# EAGLE design NEO-Pi-RAK-3 (EAGLE 8.2.2)
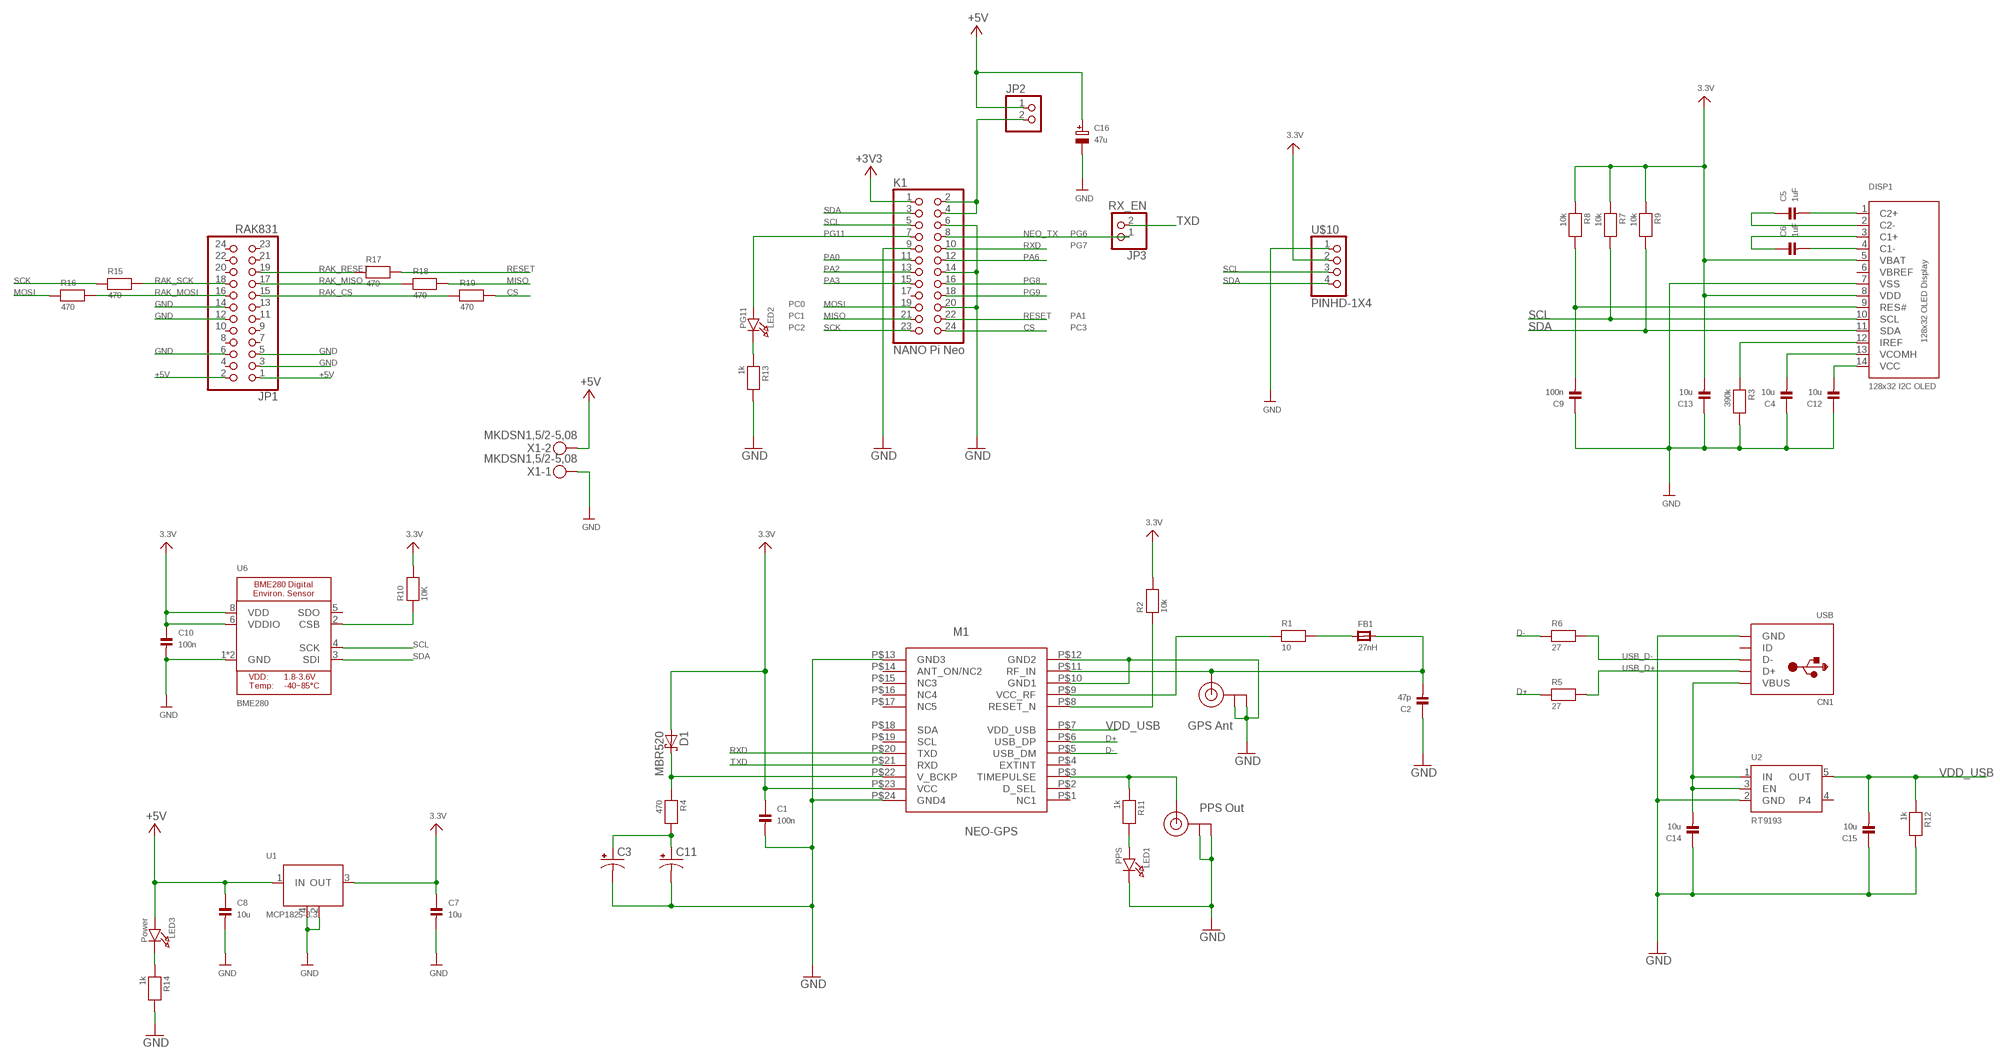
[diagram p0: schematic, sheet 1]

## Parts
C1  100n  CAP_CERAMIC0805  [0805]
C2  47p  CAP_CERAMIC0805  [0805]
C3  SUPERCAP  [414-VA5R]
C4  10u  CAP_CERAMIC0805  [0805]
C5  1uF  CAP_CERAMIC0805  [0805]
C6  1uF  CAP_CERAMIC0805  [0805]
C7  10u  CAP_CERAMIC0805  [0805]
C8  10u  CAP_CERAMIC0805  [0805]
C9  100n  CAP_CERAMIC0805  [0805]
C10  100n  CAP_CERAMIC0805  [0805]
C11  SUPERCAP  [SUPERCAP]
C12  10u  CAP_CERAMIC0805  [0805]
C13  10u  CAP_CERAMIC0805  [0805]
C14  10u  CAP_CERAMIC0805  [0805]
C15  10u  CAP_CERAMIC0805  [0805]
C16  47u  CAP_TANTALUMB/3528_REFLOW  [EIA3528-21/B-R]
CN1  USB  USBMINIB  [USB-MINIB]
D1  MBR520  MBR0520  [SOD123]
DISP1  128x32 I2C OLED  0.91-128X32-OLED-I2C  [0.91-128X32-OLED-I2C]
FB1  27nH  FERRITE0805  [0805]
JP1  RAK831  PINHD-2X12  [2X12]
JP2  PINHD-1X2  [1X02]
JP3  RX_EN  PINHD-1X2  [1X02]
K1  NANO Pi Neo  PINHD-2X12  [2X12]
LED1  PPS  LED0805  [CHIPLED_0805]
LED2  PG11  LED0805  [CHIPLED_0805]
LED3  Power  LED0805  [CHIPLED_0805]
M1  NEO-GPS  [NEO_GPS]
R1  10  RESISTOR0805  [0805]
R2  10k  RESISTOR0805  [0805]
R3  390k  RESISTOR0805  [0805]
R4  470  RESISTOR0805  [0805]
R5  27  RESISTOR0805  [0805]
R6  27  RESISTOR0805  [0805]
R7  10k  RESISTOR0805  [0805]
R8  10k  RESISTOR0805  [0805]
R9  10k  RESISTOR0805  [0805]
R10  10K  RESISTOR0805  [0805]
R11  1k  RESISTOR0805  [0805]
R12  1k  RESISTOR0805  [0805]
R13  1k  RESISTOR0805  [0805]
R14  1k  RESISTOR0805  [0805]
R15  470  RESISTOR0805  [0805]
R16  470  RESISTOR0805  [0805]
R17  470  RESISTOR0805  [0805]
R18  470  RESISTOR0805  [0805]
R19  470  RESISTOR0805  [0805]
U1  MCP1825-3.3  MCP1825ST-3.3  [UA78M05]
U2  RT9193  VREG_SOT23-5  [SOT23-5]
U6  BME280  [BME280]
U$1  U.FL  [U.FL]
U$2  U.FL  [U.FL]
U$10  PINHD-1X4  [1X04-BIG]
X1  MKDSN1,5/2-5,08  [MKDSN1,5/2-5,08]

## Nets
3.3V: C1.1 C7.1 C10.1 C13.2 D1.A DISP1.5(VBAT) DISP1.8(VDD) M1.P$23(VCC) R2.2 R7.1 R8.1 R9.1 R10.2 U1.3(OUT) U6.6(VDDIO) U6.8(VDD) U$10.2
+3V3: K1.1
+5V: C8.1 C16.+ JP1.1 JP1.2 JP2.1 LED3.A U1.1(IN) X1.2
CS: K1.24 R19.2
D+: M1.P$6(USB_DP) R5.1
D-: M1.P$5(USB_DM) R6.1
GND: C1.2 C2.1 C3.- C4.1 C7.2 C8.2 C9.1 C10.2 C11.P$2(-) C12.1 C13.1 C14.1 C15.1 C16.- CN1.GND DISP1.7(VSS) JP1.3 JP1.5 JP1.6 JP1.12 JP1.14 K1.6 K1.9 K1.14 K1.20 LED1.C M1.P$10(GND1) M1.P$12(GND2) M1.P$13(GND3) M1.P$24(GND4) R3.2 R12.2 R13.2 R14.2 U1.2(COMMON1) U1.4(COMMON2) U2.2(GND) U6.1(GND) U6.7(GND) U$1.P$1(GND) U$1.P$2(GND) U$2.P$1(GND) U$2.P$2(GND) U$10.1 X1.1
MISO: K1.21 R18.2
MOSI: K1.19 R16.1
N$1: JP2.2 K1.2 K1.4
N$2: M1.P$3(TIMEPULSE) R11.1 U$2.P$3(SIGNAL)
N$3: C2.2 FB1.2 M1.P$11(RF_IN) U$1.P$3(SIGNAL)
N$4: FB1.1 R1.2
N$5: C12.2 DISP1.14(VCC)
N$6: M1.P$9(VCC_RF) R1.1
N$7: M1.P$8(RESET_N) R2.1
N$8: D1.C M1.P$22(V_BCKP) R4.1
N$9: C3.+ C11.P$1(+) R4.2
N$10: C4.2 DISP1.13(VCOMH)
N$11: LED1.A R11.2
N$12: C5.2 DISP1.1(C2+)
N$13: C6.2 DISP1.4(C1-)
N$14: C6.1 DISP1.3(C1+)
N$15: C5.1 DISP1.2(C2-)
N$16: C14.2 CN1.VBUS U2.1(IN) U2.3(EN)
N$17: DISP1.12(IREF) R3.1
N$18: LED3.C R14.1
N$19: R10.1 U6.2(CSB)
N$20: LED2.C R13.1
NEO_TX: JP3.1 K1.8
PA0: K1.11
PA2: K1.13
PA3: K1.15
PA6: K1.12
PG8: K1.16
PG9: K1.18
PG11: K1.7 LED2.A
RAK_CS: JP1.15 R19.1
RAK_MISO: JP1.17 R18.1
RAK_MOSI: JP1.16 R16.2
RAK_RESET: JP1.19 R17.1
RAK_SCK: JP1.18 R15.2
RESET: K1.22 R17.2
RST_OLED: C9.2 DISP1.9(RES#) R8.2
RXD: K1.10 M1.P$20(TXD)
SCK: K1.23 R15.1
SCL: DISP1.10(SCL) K1.5 R7.2 U6.4(SCK) U$10.3
SDA: DISP1.11(SDA) K1.3 R9.2 U6.3(SDI) U$10.4
TXD: JP3.2 M1.P$21(RXD)
USB_D+: CN1.D+ R5.2
USB_D-: CN1.D- R6.2
VDD_USB: C15.2 M1.P$7(VDD_USB) R12.1 U2.5(OUT)
Unconnected: CN1.ID JP1.4 JP1.7 JP1.8 JP1.9 JP1.10 JP1.11 JP1.13 JP1.20 JP1.21 JP1.22 JP1.23 JP1.24 K1.17 M1.P$1(NC1) M1.P$2(D_SEL) M1.P$4(EXTINT) M1.P$14(ANT_ON/NC2) M1.P$15(NC3) M1.P$16(NC4) M1.P$17(NC5) M1.P$18(SDA) M1.P$19(SCL) U2.4 U6.5(SDO)

## Notes on the sheet
- PG6
- PG7
- PC0
- PC1 | PA1
- PC2 | PC3
- GPS Ant
- PPS Out

## Power pins joined to a net without a drawn wire
VBREF: DISP1.6(VBREF)

## Library data of the parts
C1 C2 C4-C10 C12-C15 = microbuilder:CAP_CERAMIC: Ceramic Capacitors 0402 - 0402 Surface Mount Capacitors 16pF 50V 5% [Digikey: 445-4899-2-ND] 18pF 50V 5% [Digikey: 490-1281-2-ND] 22pF 50V 5% [Digikey: 490-1283-2-ND] 68pF 50V 5% [Digikey: 490-1289-2-ND] 0.1uF 10V 10% [Digikey: 490-1318-2-ND] 1.0uF 6.3V 10% [Digikey: 490-1320-2-ND] 0603 - 0603 Surface Mount Capacitors 16 pF 50V 5% [Digikey: 445-5051-2-ND] 22 pF 50V [Digikey: PCC220ACVTR-ND] 33 pF 50V 5% [Digikey: 490-1415-1-ND] 56pF 50V 5% [Digikey: 490-1421-1-ND] 220pF 50V 5% [Digikey: 445-1285-1-ND] 680 pF 50V 2200 pF 50V 5% C0G [Digikey: 445-1297-1-ND] 5600 pF 100V 5% X7R [Digikey: 478-3711-1-ND] 0.1 µF 25V 10% [Digikey: PCC2277TR-ND] 0.22 µF 16V 10% X7R [Digikey: 445-1318-1-ND] 1.0 µF 25V 10% [Digikey: 445-5146-2-ND] 0603 - RF Specific 3pF 250V +/-0.1pF RF [Digikey: 712-1347-1-ND] 18 pF 250V 5% [Digikey: 478-3505-1-ND or 712-1322-1-ND] 56 pF 250V 5% C0G RF [Digikey: 490-4867-1-ND] 68 pF 250V RF [Digikey: 490-4868-1-ND] 0805 - 0805 Surface Mount Capacitors 220 pF 250V 2% RF Ceramic Capacitor [Digikey: 712-1398-1-ND] 1000 pF 50V 2% NP0 Ceramic Capacitor [Digikey: 478-3760-1-ND] 0.1 µF 25V 10% Ceramic Capacitor [Digikey: PCC1828TR-ND] 1.0 µF 16V 10% Ceramic Capacitor[Digikey: 490-1691-2-ND] 10.0 µF 10V 10% Ceramic Capacitor[Digikey: 709-1228-1-ND] 10.0 uF 16V 10% Ceramic Capacitor [Digikey: 478-5165-2-ND] 47 uF 6.3V 20% Ceramic Capacitor [Digikey: 587-1779-1-ND or 399-5506-1-ND] 1206 - 1206 Surface Mount Capacitors 47uF 10V 20% Ceramic Capacitor [Digikey: 490-5528-1-ND or 399-5508-1-ND or 445-6010-1-ND] 100uF 6.3V -20%, +80% Y5V Ceramic Capacitor (Digikey: 490-4512-1-ND, Mouser: 81-GRM31CF50J107ZE1L)
C3 = adafruit:SUPERCAP
C11 = Peters:SUPERCAP
C16 = microbuilder:CAP_TANTALUM: Tantalum Capacitors Wave footprints have larger pads and are meant to be used for hand soldering. Reflow footprints are optimised for solder paste and a reflow oven. EIA3216-18/A-[R/W] - Size A / 3216-18 / 1206 footprint 4.7µF 25V 10% Tantalum Capacitor 10µF 16V 10% Tantalum Capacitor [Digikey: 495-2236-2-ND] EIA3528-21/B-[R/W] - Size B / 3528-21 47µF 10V 10% Tantalum Capactior [Digikey: 495-2216-1-ND] EIA6032-28/C-[R/W] - Size C / 6032-28 10µF 35V 20% Tantalum Capacitor [Digikey: 495-2285-1-ND] 100µF 16V 10% Tantalum Capactior [Digikey: 399-5214-1-ND]
CN1 = adafruit:USB: USB Connectors USBMINIB - Surface Mount Female Mini-B USB Connector 4UConnector: 06564 By microbuilder.eu Thru-hole RA Female Mini-B USB Connector 4UConnector: 18732 By ladyada.net
D1 = Peters:MBR0520
DISP1 = Peters:0.91-128X32-OLED-I2C: SSD1306 128x32 OLED Display - I2C
FB1 = microbuilder:FERRITE: Ferrite Bead 0603 MMZ1608B121C - 120 Ohm @ 100MHz, 600mA, 0.15 Ohm DC Resistance - Digikey: 445-2164-1-ND BK1608HW121-T - 120 Ohm, 600mA Ferrite Chip - Digikey: 587-1876-2-ND 0805 HZ0805B272R-10 - 2.7K Ohm @ 100MHz, 200mA, 0.8 Ohm DC Resistance - Digikey: 240-2504-1-ND (see also Murata BLM21BD272SN1L) MMZ2012Y152B - 1.5K Ohm @ 100MHz, 500mA, 0.4 Ohm DC Resistance - Digikey: 445-1560-1-ND - Mainly for high frequency (80-400MHz) MMZ2012R102A - 1K Ohm @ 100MHz, 500mA, 0.3 Ohm DC Resistance - Digikey: 445-1555-2-ND - More general purpose (10-200MHz)
JP1 K1 = pinhead:PINHD-2X12: PIN HEADER
JP2 JP3 = pinhead:PINHD-1X2: PIN HEADER
LED1-LED3 = microbuilder:LED: LED 0603 - 0603 Surface Mount Package 2mA: Green LED - Low Power (3.9mcd, 2ma, 1.7Vf) - Digikey: 475-2709-2-ND Orange LED - Low Power (9.8mcd, 2ma, 1.8Vf) - Digikey: 475-1194-2-ND Red LED - Low Power (5mcd, 2ma, 1.8Vf) - Digikey: 475-1195-2-ND Yellow LED - Low Power (7mcd, 2ma, 1.8Vf) - Digikey: 475-1196-2-ND 5mA: Blue LED - Low Power (17mcd, 5ma, 2.9Vf) - Digikey: LNJ937W8CRACT-ND 0805 - 0805 Surface Mount Package 2mA: Red LED (8.8mcd, 2mA, 1.8Vf, Clear) - Low Power [Digikey: 475-2510-1-ND] Green LED (5mcd, 2mA, 1.8Vf, Clear) - Low Power [Digikey: 475-2730-1-ND] Yellow LED (11.3mcd, 2mA, 1.8Vf, Clear) - Low Power [Digikey: 475-2555-1-ND] 20mA: Red LED (104mcd, 20mA, Diffused) - LS R976 [Digikey: 475-1278-6-ND] Red LED (12mcd, 20mA, 2.0Vf, Clear) - APT2012EC [Digikey: 754-1128-1-ND] Green LED (15mcd, 20mA, 2.2Vf, Clear) - APT2012GC [Digikey: 754-1131-1-ND] Orange LED (160mcd, 20mA, 2.1Vf, Clear) - APT2012SECK [Digikey: 754-1130-1-ND] 1206 - 1206 Surface Mount Package Green LED (26mcd, 20mA, Diffused) - LG N971 [Digikey: 475-1407-6-ND] Red LED (15mcd, 20mA, Diffused) - LH N974 [Digikey: 475-1416-6-ND]
M1 = Peters:NEO-GPS
R1-R19 = microbuilder:RESISTOR: Resistors 0402 - 0402 Surface Mount Package 22 Ohm 1% 1/16W [Digikey: 311-22.0LRTR-ND] 33 Ohm 5% 1/16W 1.0K 5% 1/16W 1.5K 5% 1/16W 2.0K 1% 1/16W 10.0K 1% 1/16W [Digikey: 311-10.0KLRTR-ND] 10.0K 5% 1/16W [Digikey: RMCF0402JT10K0TR-ND] 12.1K 1% 1/16W [Digikey: 311-22.0LRTR-ND] 100.0K 5% 1/16W 0603 - 0603 Surface Mount Package 0 Ohm 1/10 Watt 1% Resistor 15 Ohm 1/10 Watt 1% Resistor 33 Ohm 1/10 Watt 1% Resistor 49.9 Ohm 1/10 Watt 1% Resistor 100 Ohm 1/10 Watt 1% Resistor 150 Ohm 1/10 Watt 1% Resistor 240 Ohm 1/10 Watt 1% Resistor 390 Ohm 1/10 Watt 1% Resistor 560 Ohm 1/10 Watt 1% Resistor 680 Ohm 1/10 Watt 1% Resistor 750 Ohm 1/10 Watt 1% Resistor 1.0K Ohm 1/10 Watt 1% Resistor 1.5K Ohm 1/10 Watt 1% Resistor 2.0K Ohm 1/10 Watt 1% Resistor 2.2K Ohm 1/10 Watt 1% Resistor 3.3K Ohm 1/10 Watt 1% Resistor 4.7K Ohm 1/10 Watt 1% Resistor 10.0K Ohm 1/10 Watt 1% Resistor 12.0K Ohm 1/10 Watt 1% Resistor 12.1K Ohm 1/10 Watt 1% Resistor 20.0K Ohm 1/10 Watt 1% Resistor 33.0K Ohm 1/10 Watt 1% Resistor 100.0K Ohm 1/10 Watt 1% Resistor 0805 - 0805 Surface Mount Package 0 Ohm 1/8 Watt 1% Resistor 33 Ohm 1/8 Watt 1% Resistor 100 Ohm 1/8 Watt 1% Resistor 150 Ohm 1/8 Watt 1% Resistor 200 Ohm 1/8 Watt 1% Resistor 240 Ohm 1/8 Watt 1% Resistor 330 Ohm 1/8 Watt 1% Resistor 390 Ohm 1/8 Watt 1% Resistor 470 Ohm 1/8 Watt 1% Resistor 1.0K Ohm 1/8 Watt 1% Resistor 1.5K Ohm 1/8 Watt 1% Resistor 2.0K Ohm 1/8 Watt 1% Resistor 4.7K Ohm 1/8 Watt 1% Resistor 5.1K Ohm 1/8 Watt 1% Resistor 5.6K Ohm 1/8 Watt 1% Resistor 10.0K Ohm 1/8 Watt 1% Resistor 22.0K Ohm 1/8 Watt 1% Resistor 33.0K Ohm 1/8 Watt 1% Resistor 100K Ohm 1/8 Watt 1% Resistor 1206 - 1206 Surface Mount Package 2012 - 2010 Surface Mount Package 0.11 Ohm 1/2 Watt 1% Resistor - Digikey: RHM.11UCT-ND
U1 = Peters:MCP1825ST-3.3: 3.3V LDO SOT223-3 Regulator
U2 = microbuilder:VREG_SOT23-5: SOT23-5 Fixed Voltage Regulators To better organise some of the SOT23-5 fixed voltage regulators in this library, this new part was created. Part Current Out V Out V In V Dropout Digikey Part No. ADP121 150mA 3.3V 3.4-5.5V 0.09V @ 150mA ADP121-AUJZ33R7CT-ND ADP121 150mA 3.0V 3.1-5.5V 0.09V @ 150mA ADP121-AUJZ30R7CT-ND ADP122 300mA 3.3V 3.4-5.5V 0.085V @ 300mA ADP122AUJZ-3.3-R7CT-ND ADP1712 300mA 3.3V 3.5-5.5V 0.17V @ 300mA ADP1712AUJZ-3.3-R7TR-ND AP7311 (Low Cost) 150mA 3.3V 3.5-6V 0.15V @ 150mA AP7311-33WG-7DICT-ND LD39015M18R 150mA 1.8V 1.9V-5.5V 0.08V @ 100mA 497-6977-1-ND MCP1824T-3302E/OT 300mA 3.3V 3.5V-6V 0.2V @ 300mA MCP1824T-3302E/OTCT-ND MIC5205-2.5YM5 TR 150mA 2.5V 2.7-16V 0.165V @ 150mA 576-1257-2-ND MIC5205-3.0YM5 TR 150mA 3.0V 3.2V-16V 0.165V @ 150mA 576-1258-2-ND MIC5205-3.3YM5 TR 150mA 3.3V 3.5V-16V 0.165V @ 150mA 576-1259-2-ND TPS780330220 150mA 3.3V+2.2V 3.6-5.5V 250mV Max 296-23332-1-ND TDA3663/N1,135 100mA 3.3V 3.5-45V 0.18V @ 50mA 568-5343-1-ND
U6 = microbuilder-3:BME280: BME280 - Environmental Sensor (I2C + SPI)
U$1 U$2 = Adafruit Ultimate GPS:U.FL: U.FL Antenna Connector
U$10 = adafruit:PINHD-1X4
X1 = con-phoenix-508:MKDSN1,5/2-5,08: MKDSN 1,5/ 2-5,08 Printklemme Nennstrom: 13,5 A Nennspannung: 250 V Rastermaß: 5,08 mm Polzahl: 2 Anschlussart: Schraubanschluss Montage: Löten Anschlussrichtung Leiter/Platine: 0 ° Artikelnummer: 1729128 Source: http://eshop.phoenixcontact.com .. 1729128.pdf

## Board
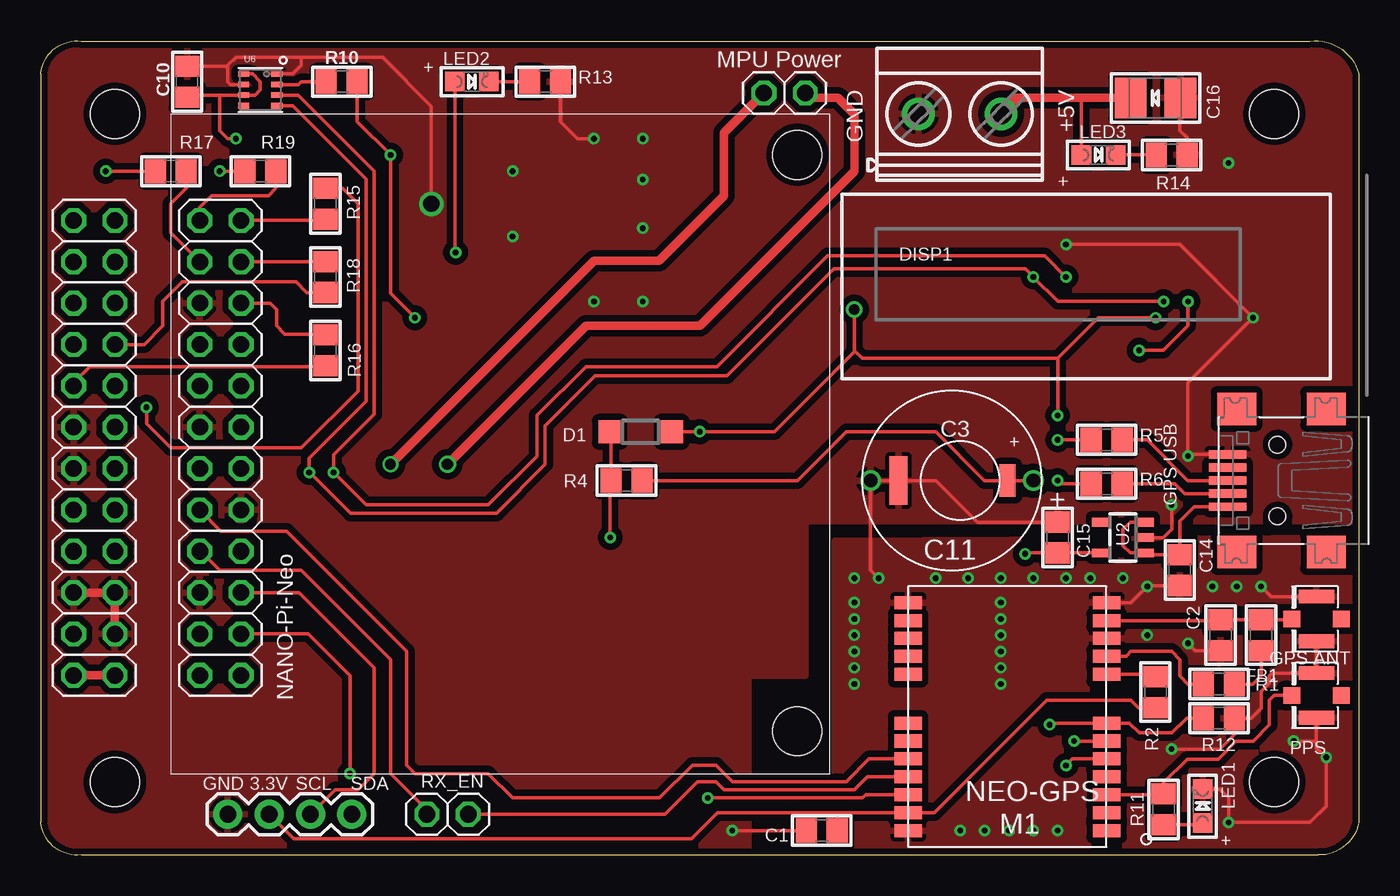
[diagram p1: board, top side]
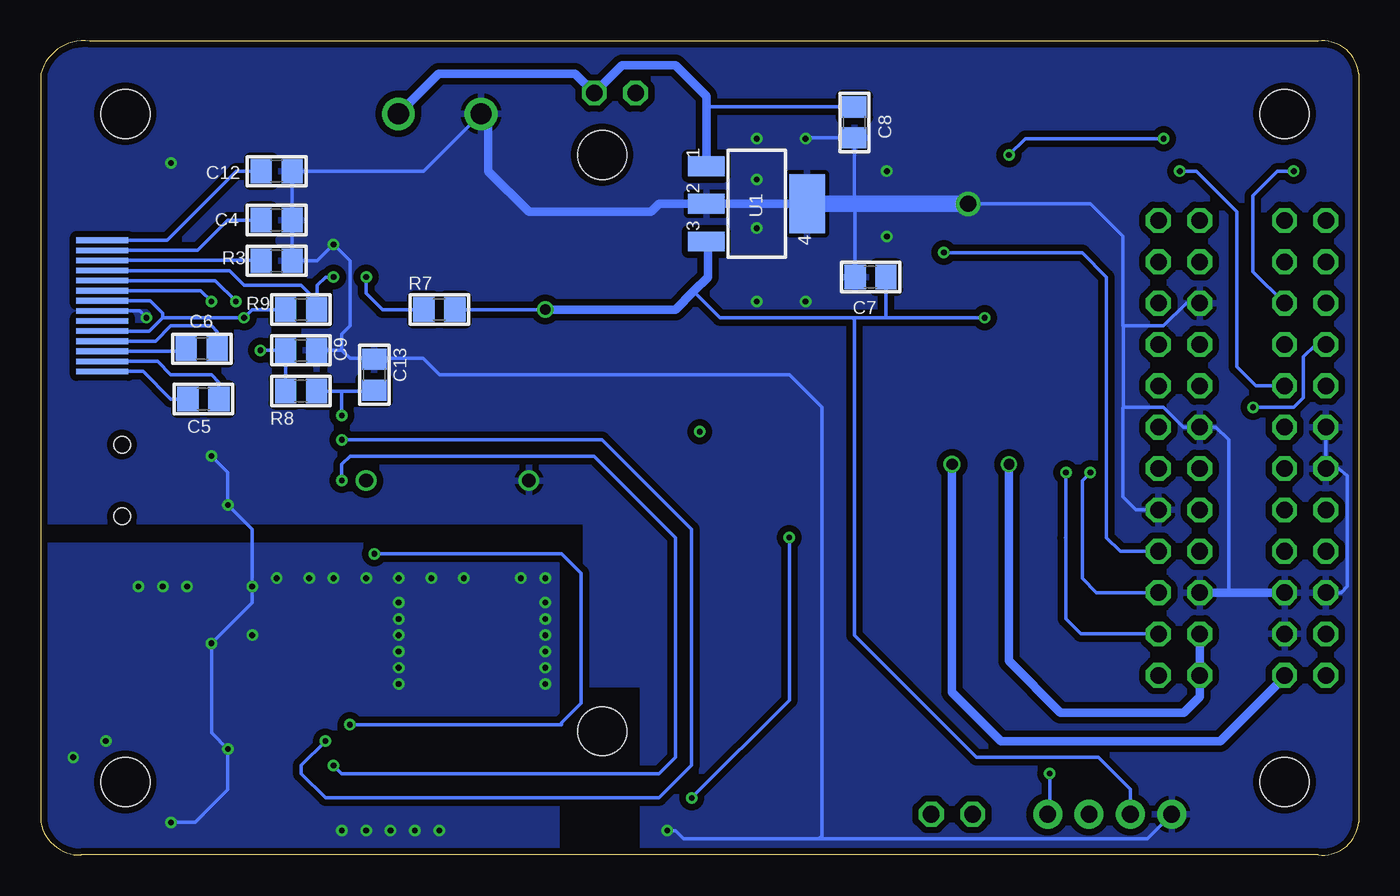
[diagram p2: board, bottom side, seen from below]

Size 81 x 50.03 mm. Coordinates in mm from the lower left corner, seen from the top.
Outline: 2.5,0.01 78.5,0.01 arc81 81,2.01 81,48.01 arc81 78,50.01 2.5,50.01 arc90 0,48.01 0,2.01 arc90 2.5,0.01
Copper layers (1*16): Top 0.0356mm / dielectric 1.5011mm / Bottom 0.0356mm
Design rules "oshpark-2layer": minimum track width 6mil, minimum drill 13mil, track to track 6mil, track to pad 6mil, pad to pad 6mil, via to via 6mil, smd to smd 6mil, copper to edge 15mil, drill to drill 6mil, minimum pad ring 7mil, minimum via ring 7mil, stop-mask expansion 2.5mil, vias tented up to drill 0mil, thermal gap 10mil
Holes 3 mm at 4.56,45.54 4.56,4.49 75.79,4.49 75.79,45.54 46.5,7.61 46.5,43.01

### Footprints (pad centres in the part's own frame; a part is rotated, then mirrored left to right if it is on the bottom)
0805 = smd 1.3 x 1.5: 1 -0.95,0; 2 0.95,0
414-VA5R = smd 1 x 2: + -2.9,0 | smd 1.1 x 3: - 3.8,0
SUPERCAP = drill 0.85: P$1 -5,0; P$2 5,0
EIA3528-21/B-R = smd 1.95 x 2.5: + 1.525,0; - -1.525,0
USB-MINIB = smd 0.5 x 2.308: D+ 0,4.064; D- -0.8,4.064; GND 1.6,4.064; ID 0.8,4.064; VBUS -1.6,4.064 | smd 2 x 2.4: GND1 -4.4,-2; GND2 -4.4,3.5; GND3 4.4,3.5; GND4 4.4,-2 | hole 1: -2.2,1; 2.2,1
SOD123 = smd 1.4 x 1.4: A 1.265,0; C -2.535,0
0.91-128X32-OLED-I2C = smd 3.2 x 0.35 bottom: 1 13.21,-5.3; 2 13.21,-4.68; 3 13.21,-4.06; 4 13.21,-3.44; 5 13.21,-2.82; 6 13.21,-2.2; 7 13.21,-1.58; 8 13.21,-0.96; 9 13.21,-0.34; 10 13.21,0.28; 11 13.21,0.9; 12 13.21,1.52; 13 13.21,2.14; 14 13.21,2.76
2X12 = drill 1.016 octagon: 1 -13.97,-1.27; 2 -13.97,1.27; 3 -11.43,-1.27; 4 -11.43,1.27; 5 -8.89,-1.27; 6 -8.89,1.27; 7 -6.35,-1.27; 8 -6.35,1.27; 9 -3.81,-1.27; 10 -3.81,1.27; 11 -1.27,-1.27; 12 -1.27,1.27; 13 1.27,-1.27; 14 1.27,1.27; 15 3.81,-1.27; 16 3.81,1.27; 17 6.35,-1.27; 18 6.35,1.27; 19 8.89,-1.27; 20 8.89,1.27; 21 11.43,-1.27; 22 11.43,1.27; 23 13.97,-1.27; 24 13.97,1.27
1X02 = drill 1.016 octagon: 1 -1.27,0; 2 1.27,0
CHIPLED_0805 = smd 1.2 x 1.2: A 0,-1.05; C 0,1.05
NEO_GPS = smd 1.7 x 0.8: P$1 0,0; P$2 0,1.1; P$3 0,2.2; P$4 0,3.3; P$5 0,4.4; P$6 0,5.5; P$7 0,6.6; P$8 0,9.6; P$9 0,10.7; P$10 0,11.8; P$11 0,12.9; P$12 0,14; P$13 -12.2,14; P$14 -12.2,12.9; P$15 -12.2,11.8; P$16 -12.2,10.7; P$17 -12.2,9.6; P$18 -12.2,6.6; P$19 -12.2,5.5; P$20 -12.2,4.4; P$21 -12.2,3.3; P$22 -12.2,2.2; P$23 -12.2,1.1; P$24 -12.2,0
UA78M05 = smd 1.219 x 2.235: 1 -2.311,-3.099; 2 0,-3.099; 3 2.311,-3.099 | smd 3.6 x 2.2: 4 0,3.099
SOT23-5 = smd 0.55 x 1.2: 1 -0.95,-1.3; 2 0,-1.3; 3 0.95,-1.3; 4 0.95,1.3; 5 -0.95,1.3
BME280 = smd 0.7 x 0.35: 1 1.025,0.975; 2 1.025,0.325; 3 1.025,-0.325; 4 1.025,-0.975; 5 -1.025,-0.975; 6 -1.025,-0.325; 7 -1.025,0.325; 8 -1.025,0.975
U.FL = smd 2.2 x 0.85: P$1 0,1.375; P$2 0,-1.375 | smd 1.05 x 1: P$3 1.525,0; P$4 -1.525,0
1X04-BIG = drill 1.016 pad 1.778: 1 0,0; 2 2.54,0; 3 5.08,0; 4 7.62,0
MKDSN1,5/2-5,08 = drill 1.3 pad 2: 1 -2.561,0.025; 2 2.519,0.025

### Placement (x,y rotation side)
C1  48,1.51 180 top
C2  72.5,13.51 90 top
C3  56.5,23.01 180 top
C4  66.5,39.01 180 bottom
C5  71,28.01 180 bottom
C6  71.1,31.11 0 bottom
C7  30,35.51 180 bottom
C8  31,45.01 270 bottom
C9  65,31.01 180 bottom
C10  9,47.51 90 top
C11  56,23.01 180 top
C12  66.5,42.01 180 bottom
C13  60.5,29.51 270 bottom
C14  70,17.51 90 top
C15  62.5,19.51 270 top
C16  68.5,46.51 180 top
CN1  77,23.01 90 top
D1  37.5,26.01 0 top
DISP1  64,35.01 0 top
FB1  75,13.51 90 top
JP1  3.29,25.02 90 top
JP2  45.71,46.82 180 top
JP3  25,2.51 0 top
K1  11.05,25.02 90 top
LED1  71.4,3.01 0 top
LED2  26.5,47.51 270 top
LED3  65,43.01 270 top
M1  65.5,1.51 0 top
R1  72.4,10.51 0 top
R2  68.5,10.01 270 top
R3  66.5,36.51 0 bottom
R4  36,23.01 0 top
R5  65.5,25.51 0 top
R6  65.5,22.81 0 top
R7  56.5,33.51 180 bottom
R8  65,28.51 180 bottom
R9  65,33.51 0 bottom
R10  18.5,47.51 0 top
R11  69,2.81 270 top
R12  72.4,8.41 0 top
R13  31,47.51 0 top
R14  69.5,43.01 0 top
R15  17.5,40.01 90 top
R16  17.5,31.01 270 top
R17  8,42.01 0 top
R18  17.5,35.51 90 top
R19  13.5,42.01 0 top
U1  37,40.01 270 bottom
U2  66.5,19.51 90 top
U6  13.5,47.01 0 top
U$1  78.4,14.51 180 top
U$2  78.4,9.81 180 top
U$10  11.5,2.51 0 top
X1  56.5,45.51 0 top

### Tracks (layer width: path | path; a pad name or v marks a point on that pad's centre or on a via)
3.3V  (via drill 0.35, 0.65)
  Top 0.2: U6.8 13.03,47.99 13.5,47.51 13.5,47.01 13.18,46.69 U6.6 11.11,46.69 | 11.11,46.69 9.03,46.69 C10.1 | R2.2 67.45,9.06 67,9.51 61.82,9.51 54.92,2.61 M1.P$23 49.02,2.61 | v62.5,27.01 62.5,30.51 | 62.5,30.51 65,33.01 v68.5,33.01 | 62.5,30.51 50.5,30.51 50.05,30.96 | 50.05,30.96 50,31.01 v50,33.51 | 50.05,30.96 45.1,26.01 v40.5,26.01 D1.A | 49.02,2.61 41.6,2.61 40,1.01 15.54,1.01 U$10.2 | C1.1 48.95,2.54 49.02,2.61 | R10.2 19.45,45.06 v21.5,43.01 21.5,34.51 v23,33.01 | v12,44.01 11.5,44.01 11,44.51 11,46.58 11.11,46.69
  Bottom 0.2: DISP1.8 74.27,34.05 73.5,33.28 73.5,33.01 | R9.1 68,33.51 v68.5,33.01 73.5,33.01 | DISP1.5 74.32,32.19 73.5,33.01 | 62.47,28.51 R8.1 | 62.47,28.51 60.55,28.51 C13.2 | v62.5,27.01 62.5,28.48 62.47,28.51 | v50,33.51 50.02,33.51 R7.1 | 31.12,33.01 33.03,33.01 | 28.98,33.01 31.12,33.01 | 28.98,33.01 v23,33.01 | 33.05,33.03 33.03,33.01 | 31.12,33.01 31,32.9 31,13.51 23.5,6.01 16,6.01 14.04,4.05 U$10.2 | C7.1 29.05,33.08 28.98,33.01 | 40.88,34.63 39.27,33.01 33.03,33.01 | v12,44.01 20.5,44.01 v21.5,43.01
  Bottom 0.508: U1.3 40.14,37.7 40,37.56 40,35.51 40.88,34.63 42,33.51 v50,33.51 | 50,33.53 50.02,33.51
+5V  (via drill 0.7)
  Top 0.2: LED3.A 63.95,46.43 64.04,46.51
  Top 0.508: JP1.2 JP1.1 | JP2.1 47.29,46.51 49,46.51 50,45.51 50,42.01 40.5,32.51 33.5,32.51 v25,24.01 | C16.+ 64.04,46.51 59.99,46.51 X1.2
  Bottom 0.2: C8.1 39.96,45.96 40.1,46.1
  Bottom 0.508: JP1.1 4.59,11.01 4.5,11.01 8.5,7.01 22,7.01 25,10.01 v25,24.01 | X1.2 56.54,48.01 48.17,48.01 JP2.1 45.29,48.51 42,48.51 40.1,46.61 40.1,46.1 U1.1
CS
  Top 0.2: K1.24 9.78,39.79 10.5,40.51 14,40.51 14.45,40.96 R19.2
D+  (via drill 0.35)
  Top 0.2: M1.P$6 v63.5,7.01 | R5.1 v62.5,25.51
  Bottom 0.2: v62.5,25.51 46.5,25.51 41,20.01 41,5.51 43,3.51 63.5,3.51 65,5.01 65,5.51 v63.5,7.01
D-  (via drill 0.35)
  Top 0.2: M1.P$5 63.4,5.91 v63,5.51 | R6.1 62.7,22.81 v62.5,23.01
  Bottom 0.2: v62.5,23.01 62.5,24.01 62,24.51 47,24.51 42,19.51 42,6.01 43,5.01 62.5,5.01 v63,5.51
GND  (via drill 0.35, 1)
  Top 0.2: 16.06,49.01 12,49.01 11.5,48.51 11.5,48.42 | U6.1 15.47,47.99 16,48.51 16,48.95 16.06,49.01 | 16.06,49.01 21,49.01 24,46.01 v24,40.01 | U$1.P$1 U$2.P$2 76.87,11.19 | C2.1 70.95,12.56 v70.5,13.01 | v69.5,6.51 72.46,6.51 73.35,7.41 R12.2 74.4,8.41 75,9.01 75,10.08 75.5,10.58 75.5,11.01 75.67,11.19 77,11.19 | 78.4,7.06 78.4,6.61 v79,6.01 79,3.01 78,2.01 v73,2.01 73,3.51 72.45,4.06 LED1.C | 78.4,7.06 U$2.P$1 77.42,8.44 | M1.P$12 67,15.51 v68,16.51 68.05,16.56 C14.1 | U2.2 69,19.51 69.5,20.01 v69.5,21.51 | CN1.GND 70.6,24.61 v70.5,24.51 70.5,29.01 v74.5,33.01 70,37.51 v63,37.51 | U$1.P$2 75.62,15.89 v75,16.51 | C1.2 v42.5,1.51 | C15.1 57.55,20.46 55,23.01 C3.- C11.P$2 51,17.51 v51.5,17.01 | R13.2 31.95,45.06 33,44.01 v34,44.01 | R14.2 70.45,44.06 70,44.51 70,46.49 C16.- | v77,7.01 78.35,7.01 78.4,7.06 | U6.7 11.68,47.34 11.5,47.51 11.5,48.42 | C10.2 11.45,48.46 11.5,48.42
  Top 0.508: JP1.3 JP1.5 JP1.6
  Bottom 0.2: JP1.14 JP1.12 1.24,23.75 0.7,23.31 0.7,16.51 1.08,16.13 JP1.6 | 14.5,32.51 12,32.51 10.6,33.91 K1.20 | K1.9 13.7,21.21 14.5,22.01 14.5,27.49 14.47,27.51 | 14.47,27.51 12,27.51 10.78,26.29 K1.14 8.78,26.29 8,25.51 8,16.3 8.17,16.13 | v73,2.01 71.5,2.01 69.5,4.01 v69.5,6.51 70.5,7.51 v70.5,13.01 68,15.51 v68,16.51 68,20.01 v69.5,21.51 69.5,23.51 v70.5,24.51 | DISP1.7 74.92,33.43 v74.5,33.01 | C9.1 62.5,31.01 | 62.5,31.01 62,30.51 60.55,30.51 | 60.55,30.51 C13.1 | X1.1 54.05,45.43 57.46,42.01 C12.1 C4.1 R3.2 64,36.51 v63,37.51 62,36.51 62,32.51 62.5,32.01 62.5,31.01 | 14.5,32.51 14.5,38.01 16.5,40.01 v24,40.01 | 34.31,40.01 34.45,40.15 34.5,40.1 | v42.5,1.51 42,1.51 41.5,1.01 33.19,1.01 | 60.55,30.51 57.5,30.51 56.5,29.51 35,29.51 33,27.51 33,1.21 33.19,1.01 | 33.19,1.01 33.08,1.01 | 33,1.1 33.08,1.01 | C7.2 30.95,39.86 31.11,40.01 30.95,40.17 31,40.22 C8.2 33.95,44.06 v34,44.01 | U$10.1 13,1.01 33.08,1.01 | 14.47,27.51 14.47,32.49 14.5,32.51
  Bottom 0.305: 2.62,16.13 JP1.6
  Bottom 0.508: JP1.5 8.17,16.13 K1.6 | U1.4 U1.2 43,40.01 43.5,39.51 51,39.51 53.5,42.01 53.5,44.88 54.05,45.43
  Bottom 1.016: v24,40.01 31.11,40.01 U1.4 34.31,40.01
  other vias: 50,15.51 50,14.51 50,13.51 50,12.51 50,11.51 50,10.51 59,15.51 59,14.51 59,13.51 59,12.51 59,11.51 59,10.51 68,13.51 50,17.01 55,17.01 57,17.01 59,17.01 61,17.01 63,17.01 64.5,17.01 66.5,17.01 56.5,1.51 58,1.51 59.5,1.51 62.5,1.51 73.5,16.51 72,16.51 34,34.01 37,34.01 37,44.01 29,38.01 29,42.01 37,41.51 37,38.51 61,1.51 73,42.51
  pour Bottom (isolate 0.406): 49.3,19.01 81,19.01 81,0.51 49.3,0.51
  pour Top (isolate 0.406): 48.8,19.31 48.8,-0.19 81,0.01 81,19.51
  pour Top (isolate 0.406): 0,0.01 43.5,0.01 43.5,11.01 47,11.01 47,20.51 81,20.51 81,50.01 0,50.01
  pour Bottom (isolate 0.406): 0,0.01 44,0.01 44,10.51 47.5,10.51 47.5,20.51 81,20.51 81,50.01 0,50.01
MISO
  Top 0.2: K1.21 15.99,36.45 R18.2
MOSI
  Top 0.2: K1.19 14.1,33.91 14.5,33.51 14.5,32.51 15,32.01 16.95,32.01 R16.1
N$1  (via drill 0.65)
  Top 0.508: JP2.2 42,44.38 42,40.51 38,36.51 34,36.51 v21.5,24.01
  Bottom 0.508: K1.4 K1.2 9.78,9.74 10.75,8.76 18.33,8.76 21.5,11.93 v21.5,24.01
N$2
  Top 0.2: M1.P$3 69.45,3.71 R11.1 69,4.46 70.45,5.91 72.35,5.91 73.45,7.01 74.51,7.01 75.5,8 75.5,9.51 75.8,9.81 U$2.P$3
N$3
  Top 0.2: M1.P$11 72.45,14.41 C2.2 FB1.2 76.83,14.46 U$1.P$3
N$4
  Top 0.2: R1.2 74.5,10.51 75,11.01 FB1.1
N$5
  Bottom 0.2: DISP1.14 73.24,37.77 69,42.01 C12.2
N$6
  Top 0.2: M1.P$9 66.7,12.21 67,12.51 69.5,12.51 70,12.01 70,11.01 70.5,10.51 R1.1
N$7
  Top 0.2: M1.P$8 68.35,11.11 R2.1
N$8  (via drill 0.35)
  Top 0.2: v35,19.51 35,22.96 R4.1 35.05,25.93 D1.C | M1.P$22 50.7,3.71 50.5,3.51 v41,3.51
  Bottom 0.2: v35,19.51 35,9.51 v41,3.51
N$9
  Top 0.2: R4.2 46.5,23.01 49.5,26.01 55,26.01 58,23.01 C3.+ C11.P$1
N$10
  Bottom 0.2: DISP1.13 71.36,37.15 69.5,39.01 C4.2
N$11
  Top 0.2: R11.2 71.3,1.86 LED1.A
N$12
  Bottom 0.2: C5.2 73,28.01 74.7,29.71 DISP1.1
N$13
  Bottom 0.2: DISP1.4 73.94,31.57 73,32.51 70.5,32.51 70.15,32.16 C6.2
N$14
  Bottom 0.2: DISP1.3 72.21,30.95 C6.1
N$15
  Bottom 0.2: DISP1.2 73.82,30.33 73,29.51 70.5,29.51 70.05,29.06 C5.1
N$16
  Top 0.2: U2.3 66.95,20.46 66.5,20.01 66.5,19.01 66.95,18.56 U2.1 67.9,18.46 C14.2 70,20.51 70.9,21.41 CN1.VBUS
N$17
  Bottom 0.2: DISP1.12 67.47,36.53 R3.1
N$18
  Top 0.2: LED3.C R14.1
N$19
  Top 0.2: U6.2 15.82,47.34 16,47.51 R10.1
N$20
  Top 0.2: R13.1 LED2.C
NEO_TX
  Top 0.2: K1.8 9.84,18.67 11,17.51 16,17.51 21.5,12.01 21.5,5 23.73,2.77 JP3.1
PG11  (via drill 0.35)
  Top 0.2: LED2.A 25.45,37.06 v25.5,37.01
  Bottom 0.2: K1.7 14.66,18.67 15.5,19.51 15.5,35.51 17,37.01 v25.5,37.01
RAK_CS  (via drill 0.35)
  Top 0.2: R19.1 v11,42.01
  Bottom 0.2: JP1.15 6.32,28.83 7.5,30.01 7.5,39.51 10,42.01 v11,42.01
RAK_MISO
  Top 0.2: R18.1 16.35,34.56 15.7,35.21 8.7,35.21 7.5,34.01 7.5,32.51 6.36,31.37 JP1.17
RAK_MOSI
  Top 0.2: JP1.16 2.02,29.04 3,30.01 17.45,30.01 R16.2
RAK_RESET  (via drill 0.35)
  Top 0.2: R17.1 v4,42.01
  Bottom 0.2: v4,42.01 5,42.01 6.5,40.51 6.5,35.85 JP1.19
RAK_SCK  (via drill 0.35)
  Top 0.2: v6.5,27.51 6.5,26.51 8,25.01 16,25.01 19.5,28.51 19.5,40.01 18.55,40.96 R15.2
  Bottom 0.2: v6.5,27.51 4,27.51 3.4,28.11 3.4,30.61 2.64,31.37 JP1.18
RESET
  Top 0.2: R17.2 8.95,40.96 8,40.01 8,38.23 K1.22
RST_OLED  (via drill 0.35)
  Top 0.2: v70.5,34.01 70.5,32.51 69,31.01 v67.5,31.01
  Bottom 0.2: DISP1.9 71.16,34.67 v70.5,34.01 | v67.5,31.01 C9.2 R8.2
RXD
  Top 0.2: K1.10 11.07,19.91 15.1,19.91 22.5,12.51 22.5,5.51 23,5.01 27.5,5.01 29,3.51 38.04,3.51 40.04,5.51 41.5,5.51 42.5,4.51 49.5,4.51 50.9,5.91 M1.P$20
SCK
  Top 0.2: K1.23 17.43,38.99 R15.1
SCL  (via drill 0.35)
  Top 0.2: U6.4 15.47,46.04 20,41.51 20,27.88 16.5,24.38 v16.5,23.51 16.53,23.51 19.03,21.01 28,21.01 31,24.01 31,26.39 34.06,29.45 42.17,29.45 48.73,36.01 60.5,36.01 v61,35.51 62.5,34.01 v69,34.01 | K1.5 15.88,16.13 20.5,11.51 20.5,5.01 19.5,4.01 18.08,4.01 U$10.3
  Bottom 0.2: K1.5 16.12,16.13 17,17.01 17,23.01 v16.5,23.51 | DISP1.10 70.28,35.29 v69,34.01 | v61,35.51 60.95,35.46 61,35.41 61,34.51 60,33.51 R7.2
SDA  (via drill 0.35)
  Top 0.2: U6.3 15.82,46.69 20.5,42.01 20.5,27.09 18,24.59 v18,23.51 20,21.51 27.5,21.51 30.5,24.51 30.5,27.01 33.5,30.01 41.56,30.01 48.36,36.81 61.7,36.81 v63,35.51 | v19,5.01 19,11.01 16.42,13.59 K1.3
  Bottom 0.2: v18,23.51 18,19.51 18.02,19.51 18,19.49 18,14.51 17.08,13.59 K1.3 | DISP1.11 69.4,35.91 68.5,35.01 65,35.01 64.05,34.06 R9.2 64,33.56 64,35.01 63.5,35.51 v63,35.51 | v19,5.01 19,2.63 U$10.4
TXD
  Top 0.2: M1.P$21 50.8,4.81 50,4.01 42,4.01 41.5,4.51 40.37,4.51 38.37,2.51 JP3.2
USB_D+
  Top 0.2: CN1.D+ 70.5,23.01 68,25.51 R5.2
USB_D-
  Top 0.2: CN1.D- 70.3,22.21 70.02,22.49 | 70.02,22.49 70,22.51 | R6.2 69.7,22.81 70.02,22.49
VDD_USB  (via drill 0.35)
  Top 0.2: U2.5 C15.2 60.55,18.56 v60.5,18.51 | v62,8.01 62.1,8.11 M1.P$7 66.9,8.11 67.5,7.51 69.52,7.51 70.42,8.41 R12.1
  Bottom 0.2: v60.5,18.51 49,18.51 47.81,17.32 47.81,9.32 49,8.13 49,8.01 v62,8.01

### Text on the board
tNames: MPU Power | + | GND | +5V | + | GPS USB | + | GPS ANT | NANO-Pi-Neo | PPS | GND | 3.3V | SCL | SDA | +